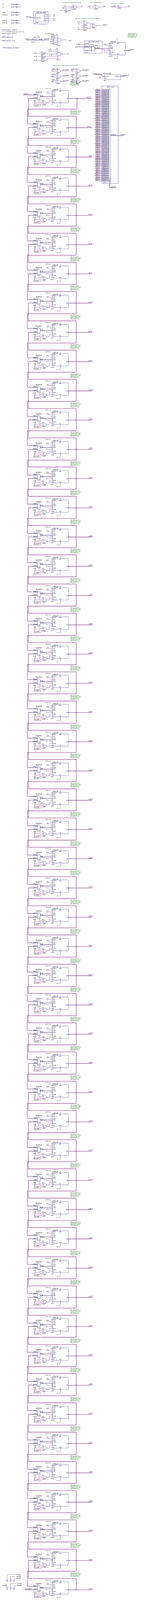
[diagram p0: schematic sheet, whole]
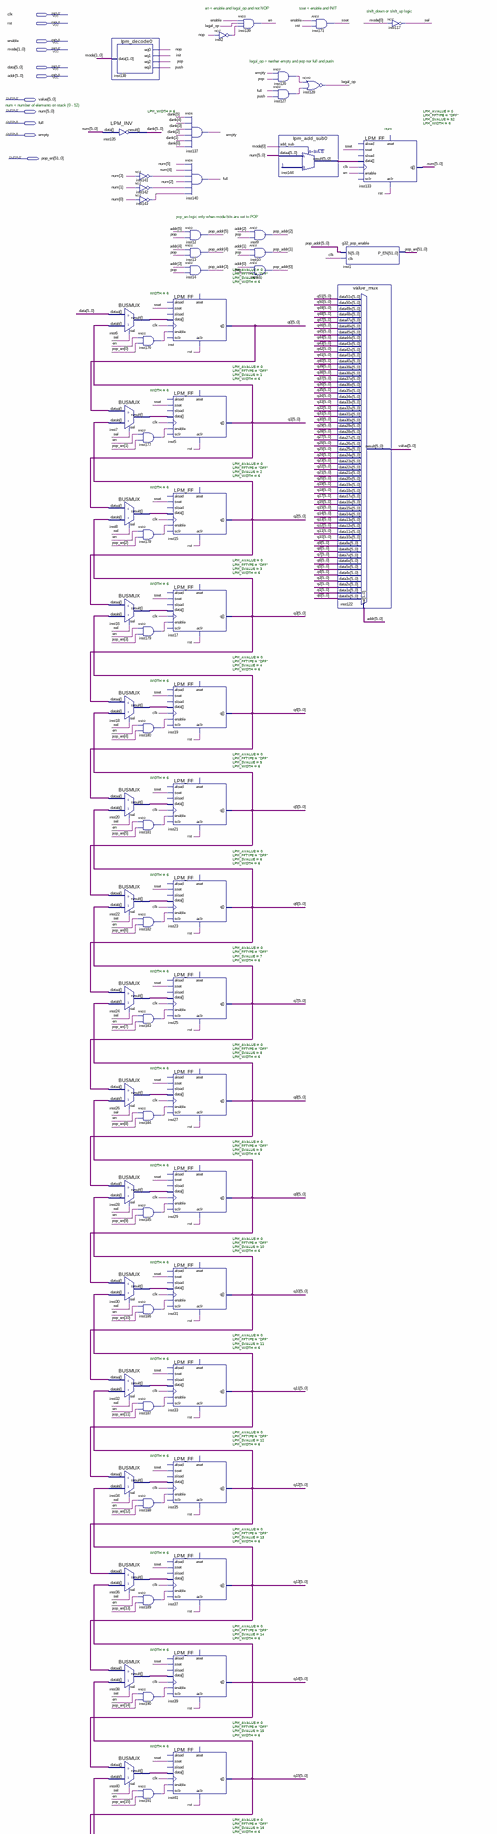
[diagram p1: schematic sheet, upper part]
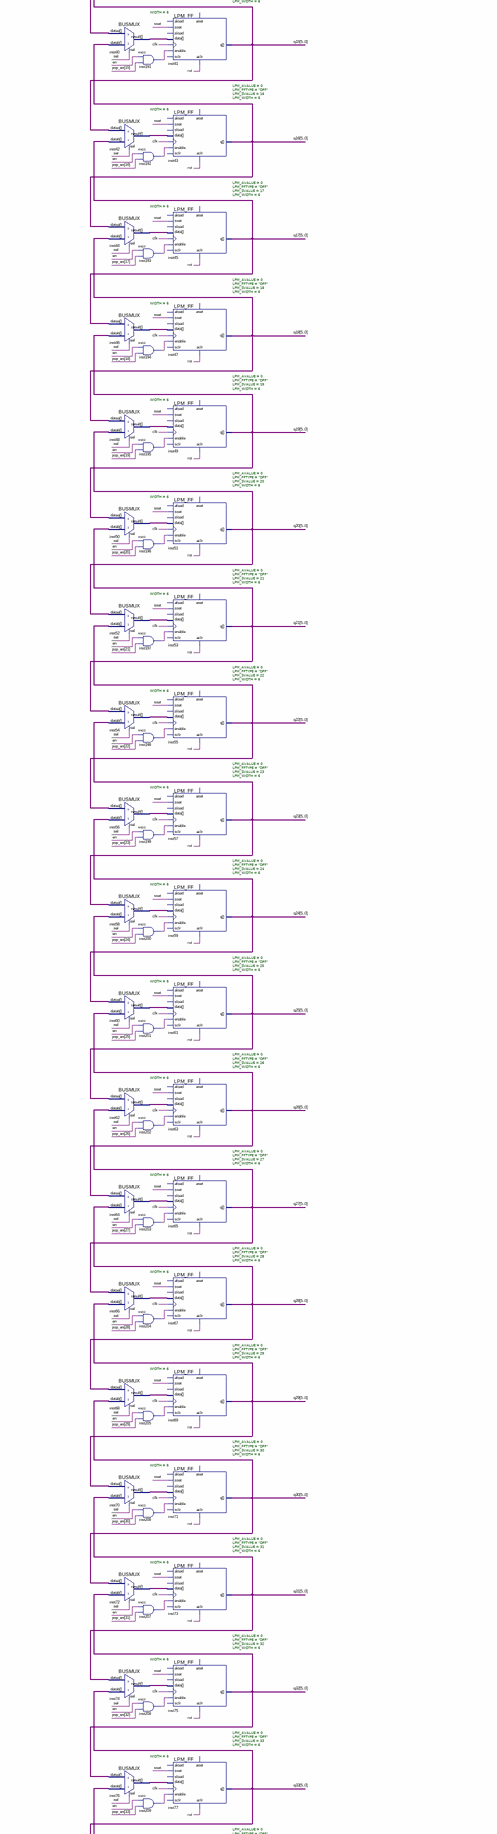
[diagram p2: schematic sheet, middle part]
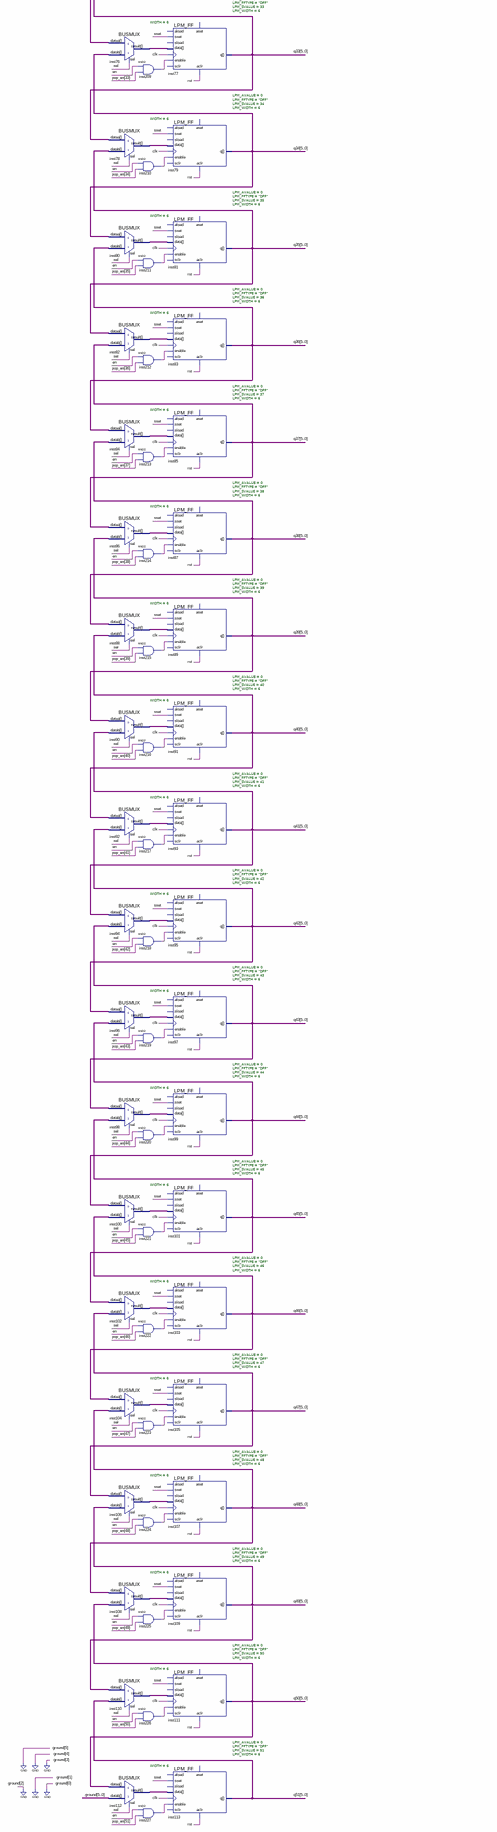
[diagram p3: schematic sheet, lower part]
// Quartus schematic g32_52_element_stack.bdf as structural Verilog: 180 symbols, 11 pins
module g32_52_element_stack (
  input  clk,
  input  rst,
  input  enable,
  input  [1:0] mode,
  input  [5:0] data,
  input  [5:0] addr,
  output [5:0] value,
  output [5:0] num,
  output full,
  output empty,
  output [51:0] pop_en
);

  wire en, init, inst2_out, inst126_out, inst127_out, inst141_out, inst142_out, inst143_out, inst176_out,
       inst177_out, inst178_out, inst179_out, inst180_out, inst181_out, inst182_out, inst183_out,
       inst184_out, inst185_out, inst186_out, inst187_out, inst188_out, inst189_out, inst190_out,
       inst191_out, inst192_out, inst193_out, inst194_out, inst195_out, inst196_out, inst197_out,
       inst198_out, inst199_out, inst200_out, inst201_out, inst202_out, inst203_out, inst204_out,
       inst205_out, inst206_out, inst207_out, inst208_out, inst209_out, inst210_out, inst211_out,
       inst212_out, inst213_out, inst214_out, inst215_out, inst216_out, inst217_out, inst218_out,
       inst219_out, inst220_out, inst221_out, inst222_out, inst223_out, inst224_out, inst225_out,
       inst226_out, inst227_out, legal_op, nop, pop, push, sel, sset;
  wire [5:0] dank, inst6_result, inst7_result, inst8_result, inst16_result, inst18_result, inst20_result,
       inst22_result, inst24_result, inst26_result, inst28_result, inst30_result, inst32_result,
       inst34_result, inst36_result, inst38_result, inst40_result, inst42_result, inst44_result,
       inst46_result, inst48_result, inst50_result, inst52_result, inst54_result, inst56_result,
       inst58_result, inst60_result, inst62_result, inst64_result, inst66_result, inst68_result,
       inst70_result, inst72_result, inst74_result, inst76_result, inst78_result, inst80_result,
       inst82_result, inst84_result, inst86_result, inst88_result, inst90_result, inst92_result,
       inst94_result, inst96_result, inst98_result, inst100_result, inst102_result, inst104_result,
       inst106_result, inst108_result, inst110_result, inst112_result, inst144_result, pop_addr, q0, q1, q2,
       q3, q4, q5, q6, q7, q8, q9, q10, q11, q12, q13, q14, q15, q16, q17, q18, q19, q20, q21, q22, q23, q24,
       q25, q26, q27, q28, q29, q30, q31, q32, q33, q34, q35, q36, q37, q38, q39, q40, q41, q42, q43, q44,
       q45, q46, q47, q48, q49, q50, q51;

  lpm_decode0 inst138 (.data(mode), .eq0(nop), .eq1(init), .eq2(pop), .eq3(push));
  LPM_INV #(.LPM_WIDTH(6)) inst135 (.data(num), .result(dank));
  BUSMUX #(.WIDTH(6)) inst6 (.datab(q1), .sel(sel), .dataa(data), .result(inst6_result));
  BUSMUX #(.WIDTH(6)) inst7 (.datab(q2), .sel(sel), .dataa(q0), .result(inst7_result));
  BUSMUX #(.WIDTH(6)) inst8 (.datab(q3), .sel(sel), .dataa(q1), .result(inst8_result));
  BUSMUX #(.WIDTH(6)) inst16 (.datab(q4), .sel(sel), .dataa(q2), .result(inst16_result));
  BUSMUX #(.WIDTH(6)) inst18 (.datab(q5), .sel(sel), .dataa(q3), .result(inst18_result));
  BUSMUX #(.WIDTH(6)) inst20 (.datab(q6), .sel(sel), .dataa(q4), .result(inst20_result));
  BUSMUX #(.WIDTH(6)) inst22 (.datab(q7), .sel(sel), .dataa(q5), .result(inst22_result));
  BUSMUX #(.WIDTH(6)) inst24 (.datab(q8), .sel(sel), .dataa(q6), .result(inst24_result));
  BUSMUX #(.WIDTH(6)) inst26 (.datab(q9), .sel(sel), .dataa(q7), .result(inst26_result));
  BUSMUX #(.WIDTH(6)) inst28 (.datab(q10), .sel(sel), .dataa(q8), .result(inst28_result));
  BUSMUX #(.WIDTH(6)) inst30 (.datab(q11), .sel(sel), .dataa(q9), .result(inst30_result));
  BUSMUX #(.WIDTH(6)) inst32 (.datab(q12), .sel(sel), .dataa(q10), .result(inst32_result));
  BUSMUX #(.WIDTH(6)) inst34 (.datab(q13), .sel(sel), .dataa(q11), .result(inst34_result));
  BUSMUX #(.WIDTH(6)) inst36 (.datab(q14), .sel(sel), .dataa(q12), .result(inst36_result));
  BUSMUX #(.WIDTH(6)) inst38 (.datab(q15), .sel(sel), .dataa(q13), .result(inst38_result));
  BUSMUX #(.WIDTH(6)) inst40 (.datab(q16), .sel(sel), .dataa(q14), .result(inst40_result));
  BUSMUX #(.WIDTH(6)) inst42 (.datab(q17), .sel(sel), .dataa(q15), .result(inst42_result));
  BUSMUX #(.WIDTH(6)) inst44 (.datab(q18), .sel(sel), .dataa(q16), .result(inst44_result));
  BUSMUX #(.WIDTH(6)) inst46 (.datab(q19), .sel(sel), .dataa(q17), .result(inst46_result));
  BUSMUX #(.WIDTH(6)) inst48 (.datab(q20), .sel(sel), .dataa(q18), .result(inst48_result));
  BUSMUX #(.WIDTH(6)) inst50 (.datab(q21), .sel(sel), .dataa(q19), .result(inst50_result));
  BUSMUX #(.WIDTH(6)) inst52 (.datab(q22), .sel(sel), .dataa(q20), .result(inst52_result));
  BUSMUX #(.WIDTH(6)) inst54 (.datab(q23), .sel(sel), .dataa(q21), .result(inst54_result));
  BUSMUX #(.WIDTH(6)) inst56 (.datab(q24), .sel(sel), .dataa(q22), .result(inst56_result));
  BUSMUX #(.WIDTH(6)) inst58 (.datab(q25), .sel(sel), .dataa(q23), .result(inst58_result));
  BUSMUX #(.WIDTH(6)) inst60 (.datab(q26), .sel(sel), .dataa(q24), .result(inst60_result));
  BUSMUX #(.WIDTH(6)) inst62 (.datab(q27), .sel(sel), .dataa(q25), .result(inst62_result));
  BUSMUX #(.WIDTH(6)) inst64 (.datab(q28), .sel(sel), .dataa(q26), .result(inst64_result));
  BUSMUX #(.WIDTH(6)) inst66 (.datab(q29), .sel(sel), .dataa(q27), .result(inst66_result));
  BUSMUX #(.WIDTH(6)) inst68 (.datab(q30), .sel(sel), .dataa(q28), .result(inst68_result));
  BUSMUX #(.WIDTH(6)) inst70 (.datab(q31), .sel(sel), .dataa(q29), .result(inst70_result));
  BUSMUX #(.WIDTH(6)) inst72 (.datab(q32), .sel(sel), .dataa(q30), .result(inst72_result));
  BUSMUX #(.WIDTH(6)) inst74 (.datab(q33), .sel(sel), .dataa(q31), .result(inst74_result));
  BUSMUX #(.WIDTH(6)) inst76 (.datab(q34), .sel(sel), .dataa(q32), .result(inst76_result));
  BUSMUX #(.WIDTH(6)) inst78 (.datab(q35), .sel(sel), .dataa(q33), .result(inst78_result));
  BUSMUX #(.WIDTH(6)) inst80 (.datab(q36), .sel(sel), .dataa(q34), .result(inst80_result));
  BUSMUX #(.WIDTH(6)) inst82 (.datab(q37), .sel(sel), .dataa(q35), .result(inst82_result));
  BUSMUX #(.WIDTH(6)) inst84 (.datab(q38), .sel(sel), .dataa(q36), .result(inst84_result));
  BUSMUX #(.WIDTH(6)) inst86 (.datab(q39), .sel(sel), .dataa(q37), .result(inst86_result));
  BUSMUX #(.WIDTH(6)) inst88 (.datab(q40), .sel(sel), .dataa(q38), .result(inst88_result));
  BUSMUX #(.WIDTH(6)) inst90 (.datab(q41), .sel(sel), .dataa(q39), .result(inst90_result));
  BUSMUX #(.WIDTH(6)) inst92 (.datab(q42), .sel(sel), .dataa(q40), .result(inst92_result));
  BUSMUX #(.WIDTH(6)) inst94 (.datab(q43), .sel(sel), .dataa(q41), .result(inst94_result));
  BUSMUX #(.WIDTH(6)) inst96 (.datab(q44), .sel(sel), .dataa(q42), .result(inst96_result));
  BUSMUX #(.WIDTH(6)) inst98 (.datab(q45), .sel(sel), .dataa(q43), .result(inst98_result));
  BUSMUX #(.WIDTH(6)) inst100 (.datab(q46), .sel(sel), .dataa(q44), .result(inst100_result));
  BUSMUX #(.WIDTH(6)) inst102 (.datab(q47), .sel(sel), .dataa(q45), .result(inst102_result));
  BUSMUX #(.WIDTH(6)) inst104 (.datab(q48), .sel(sel), .dataa(q46), .result(inst104_result));
  BUSMUX #(.WIDTH(6)) inst106 (.datab(q49), .sel(sel), .dataa(q47), .result(inst106_result));
  BUSMUX #(.WIDTH(6)) inst108 (.datab(q50), .sel(sel), .dataa(q48), .result(inst108_result));
  BUSMUX #(.WIDTH(6)) inst110 (.datab(q51), .sel(sel), .dataa(q49), .result(inst110_result));
  BUSMUX #(.WIDTH(6)) inst112 (.datab({6{1'b0}}), .sel(sel), .dataa(q50), .result(inst112_result));
  not inst141 (inst141_out, num[3]);
  not inst142 (inst142_out, num[1]);
  not inst143 (inst143_out, num[0]);
  and inst176 (inst176_out, en, pop_en[0]);
  and inst177 (inst177_out, en, pop_en[1]);
  and inst178 (inst178_out, en, pop_en[2]);
  and inst179 (inst179_out, en, pop_en[3]);
  and inst180 (inst180_out, en, pop_en[4]);
  and inst181 (inst181_out, en, pop_en[5]);
  and inst182 (inst182_out, en, pop_en[6]);
  and inst183 (inst183_out, en, pop_en[7]);
  and inst184 (inst184_out, en, pop_en[8]);
  and inst185 (inst185_out, en, pop_en[9]);
  and inst186 (inst186_out, en, pop_en[10]);
  and inst187 (inst187_out, en, pop_en[11]);
  and inst188 (inst188_out, en, pop_en[12]);
  and inst189 (inst189_out, en, pop_en[13]);
  and inst190 (inst190_out, en, pop_en[14]);
  and inst191 (inst191_out, en, pop_en[15]);
  and inst192 (inst192_out, en, pop_en[16]);
  and inst193 (inst193_out, en, pop_en[17]);
  and inst194 (inst194_out, en, pop_en[18]);
  and inst195 (inst195_out, en, pop_en[19]);
  and inst196 (inst196_out, en, pop_en[20]);
  and inst197 (inst197_out, en, pop_en[21]);
  and inst198 (inst198_out, en, pop_en[22]);
  and inst199 (inst199_out, en, pop_en[23]);
  and inst200 (inst200_out, en, pop_en[24]);
  and inst201 (inst201_out, en, pop_en[25]);
  and inst202 (inst202_out, en, pop_en[26]);
  and inst203 (inst203_out, en, pop_en[27]);
  and inst204 (inst204_out, en, pop_en[28]);
  and inst205 (inst205_out, en, pop_en[29]);
  and inst206 (inst206_out, en, pop_en[30]);
  and inst207 (inst207_out, en, pop_en[31]);
  and inst208 (inst208_out, en, pop_en[32]);
  and inst209 (inst209_out, en, pop_en[33]);
  and inst210 (inst210_out, en, pop_en[34]);
  and inst211 (inst211_out, en, pop_en[35]);
  and inst212 (inst212_out, en, pop_en[36]);
  and inst213 (inst213_out, en, pop_en[37]);
  and inst214 (inst214_out, en, pop_en[38]);
  and inst215 (inst215_out, en, pop_en[39]);
  and inst216 (inst216_out, en, pop_en[40]);
  and inst217 (inst217_out, en, pop_en[41]);
  and inst218 (inst218_out, en, pop_en[42]);
  and inst219 (inst219_out, en, pop_en[43]);
  and inst220 (inst220_out, en, pop_en[44]);
  and inst221 (inst221_out, en, pop_en[45]);
  and inst222 (inst222_out, en, pop_en[46]);
  and inst223 (inst223_out, en, pop_en[47]);
  and inst224 (inst224_out, en, pop_en[48]);
  and inst225 (inst225_out, en, pop_en[49]);
  and inst226 (inst226_out, en, pop_en[50]);
  and inst227 (inst227_out, en, pop_en[51]);
  LPM_FF #(.LPM_AVALUE(0), .LPM_FFTYPE("DFF"), .LPM_SVALUE(0), .LPM_WIDTH(6)) inst (
    .enable(inst176_out), .clock(clk), .sset(sset), .aclr(rst), .data(inst6_result), .q(q0));  // open: aload, sload, aset, sclr
  LPM_FF #(.LPM_AVALUE(0), .LPM_FFTYPE("DFF"), .LPM_SVALUE(1), .LPM_WIDTH(6)) inst5 (
    .enable(inst177_out), .clock(clk), .sset(sset), .aclr(rst), .data(inst7_result), .q(q1));  // open: aload, sload, aset, sclr
  LPM_FF #(.LPM_AVALUE(0), .LPM_FFTYPE("DFF"), .LPM_SVALUE(2), .LPM_WIDTH(6)) inst15 (
    .enable(inst178_out), .clock(clk), .sset(sset), .aclr(rst), .data(inst8_result), .q(q2));  // open: aload, sload, aset, sclr
  LPM_FF #(.LPM_AVALUE(0), .LPM_FFTYPE("DFF"), .LPM_SVALUE(3), .LPM_WIDTH(6)) inst17 (
    .enable(inst179_out), .clock(clk), .sset(sset), .aclr(rst), .data(inst16_result), .q(q3));  // open: aload, sload, aset, sclr
  LPM_FF #(.LPM_AVALUE(0), .LPM_FFTYPE("DFF"), .LPM_SVALUE(4), .LPM_WIDTH(6)) inst19 (
    .enable(inst180_out), .clock(clk), .sset(sset), .aclr(rst), .data(inst18_result), .q(q4));  // open: aload, sload, aset, sclr
  LPM_FF #(.LPM_AVALUE(0), .LPM_FFTYPE("DFF"), .LPM_SVALUE(5), .LPM_WIDTH(6)) inst21 (
    .enable(inst181_out), .clock(clk), .sset(sset), .aclr(rst), .data(inst20_result), .q(q5));  // open: aload, sload, aset, sclr
  LPM_FF #(.LPM_AVALUE(0), .LPM_FFTYPE("DFF"), .LPM_SVALUE(6), .LPM_WIDTH(6)) inst23 (
    .enable(inst182_out), .clock(clk), .sset(sset), .aclr(rst), .data(inst22_result), .q(q6));  // open: aload, sload, aset, sclr
  LPM_FF #(.LPM_AVALUE(0), .LPM_FFTYPE("DFF"), .LPM_SVALUE(7), .LPM_WIDTH(6)) inst25 (
    .enable(inst183_out), .clock(clk), .sset(sset), .aclr(rst), .data(inst24_result), .q(q7));  // open: aload, sload, aset, sclr
  LPM_FF #(.LPM_AVALUE(0), .LPM_FFTYPE("DFF"), .LPM_SVALUE(8), .LPM_WIDTH(6)) inst27 (
    .enable(inst184_out), .clock(clk), .sset(sset), .aclr(rst), .data(inst26_result), .q(q8));  // open: aload, sload, aset, sclr
  LPM_FF #(.LPM_AVALUE(0), .LPM_FFTYPE("DFF"), .LPM_SVALUE(9), .LPM_WIDTH(6)) inst29 (
    .enable(inst185_out), .clock(clk), .sset(sset), .aclr(rst), .data(inst28_result), .q(q9));  // open: aload, sload, aset, sclr
  LPM_FF #(.LPM_AVALUE(0), .LPM_FFTYPE("DFF"), .LPM_SVALUE(10), .LPM_WIDTH(6)) inst31 (
    .enable(inst186_out), .clock(clk), .sset(sset), .aclr(rst), .data(inst30_result), .q(q10));  // open: aload, sload, aset, sclr
  LPM_FF #(.LPM_AVALUE(0), .LPM_FFTYPE("DFF"), .LPM_SVALUE(11), .LPM_WIDTH(6)) inst33 (
    .enable(inst187_out), .clock(clk), .sset(sset), .aclr(rst), .data(inst32_result), .q(q11));  // open: aload, sload, aset, sclr
  LPM_FF #(.LPM_AVALUE(0), .LPM_FFTYPE("DFF"), .LPM_SVALUE(12), .LPM_WIDTH(6)) inst35 (
    .enable(inst188_out), .clock(clk), .sset(sset), .aclr(rst), .data(inst34_result), .q(q12));  // open: aload, sload, aset, sclr
  LPM_FF #(.LPM_AVALUE(0), .LPM_FFTYPE("DFF"), .LPM_SVALUE(13), .LPM_WIDTH(6)) inst37 (
    .enable(inst189_out), .clock(clk), .sset(sset), .aclr(rst), .data(inst36_result), .q(q13));  // open: aload, sload, aset, sclr
  LPM_FF #(.LPM_AVALUE(0), .LPM_FFTYPE("DFF"), .LPM_SVALUE(14), .LPM_WIDTH(6)) inst39 (
    .enable(inst190_out), .clock(clk), .sset(sset), .aclr(rst), .data(inst38_result), .q(q14));  // open: aload, sload, aset, sclr
  LPM_FF #(.LPM_AVALUE(0), .LPM_FFTYPE("DFF"), .LPM_SVALUE(15), .LPM_WIDTH(6)) inst41 (
    .enable(inst191_out), .clock(clk), .sset(sset), .aclr(rst), .data(inst40_result), .q(q15));  // open: aload, sload, aset, sclr
  LPM_FF #(.LPM_AVALUE(0), .LPM_FFTYPE("DFF"), .LPM_SVALUE(16), .LPM_WIDTH(6)) inst43 (
    .enable(inst192_out), .clock(clk), .sset(sset), .aclr(rst), .data(inst42_result), .q(q16));  // open: aload, sload, aset, sclr
  LPM_FF #(.LPM_AVALUE(0), .LPM_FFTYPE("DFF"), .LPM_SVALUE(17), .LPM_WIDTH(6)) inst45 (
    .enable(inst193_out), .clock(clk), .sset(sset), .aclr(rst), .data(inst44_result), .q(q17));  // open: aload, sload, aset, sclr
  LPM_FF #(.LPM_AVALUE(0), .LPM_FFTYPE("DFF"), .LPM_SVALUE(18), .LPM_WIDTH(6)) inst47 (
    .enable(inst194_out), .clock(clk), .sset(sset), .aclr(rst), .data(inst46_result), .q(q18));  // open: aload, sload, aset, sclr
  LPM_FF #(.LPM_AVALUE(0), .LPM_FFTYPE("DFF"), .LPM_SVALUE(19), .LPM_WIDTH(6)) inst49 (
    .enable(inst195_out), .clock(clk), .sset(sset), .aclr(rst), .data(inst48_result), .q(q19));  // open: aload, sload, aset, sclr
  LPM_FF #(.LPM_AVALUE(0), .LPM_FFTYPE("DFF"), .LPM_SVALUE(20), .LPM_WIDTH(6)) inst51 (
    .enable(inst196_out), .clock(clk), .sset(sset), .aclr(rst), .data(inst50_result), .q(q20));  // open: aload, sload, aset, sclr
  LPM_FF #(.LPM_AVALUE(0), .LPM_FFTYPE("DFF"), .LPM_SVALUE(21), .LPM_WIDTH(6)) inst53 (
    .enable(inst197_out), .clock(clk), .sset(sset), .aclr(rst), .data(inst52_result), .q(q21));  // open: aload, sload, aset, sclr
  LPM_FF #(.LPM_AVALUE(0), .LPM_FFTYPE("DFF"), .LPM_SVALUE(22), .LPM_WIDTH(6)) inst55 (
    .enable(inst198_out), .clock(clk), .sset(sset), .aclr(rst), .data(inst54_result), .q(q22));  // open: aload, sload, aset, sclr
  LPM_FF #(.LPM_AVALUE(0), .LPM_FFTYPE("DFF"), .LPM_SVALUE(23), .LPM_WIDTH(6)) inst57 (
    .enable(inst199_out), .clock(clk), .sset(sset), .aclr(rst), .data(inst56_result), .q(q23));  // open: aload, sload, aset, sclr
  LPM_FF #(.LPM_AVALUE(0), .LPM_FFTYPE("DFF"), .LPM_SVALUE(24), .LPM_WIDTH(6)) inst59 (
    .enable(inst200_out), .clock(clk), .sset(sset), .aclr(rst), .data(inst58_result), .q(q24));  // open: aload, sload, aset, sclr
  LPM_FF #(.LPM_AVALUE(0), .LPM_FFTYPE("DFF"), .LPM_SVALUE(25), .LPM_WIDTH(6)) inst61 (
    .enable(inst201_out), .clock(clk), .sset(sset), .aclr(rst), .data(inst60_result), .q(q25));  // open: aload, sload, aset, sclr
  LPM_FF #(.LPM_AVALUE(0), .LPM_FFTYPE("DFF"), .LPM_SVALUE(26), .LPM_WIDTH(6)) inst63 (
    .enable(inst202_out), .clock(clk), .sset(sset), .aclr(rst), .data(inst62_result), .q(q26));  // open: aload, sload, aset, sclr
  LPM_FF #(.LPM_AVALUE(0), .LPM_FFTYPE("DFF"), .LPM_SVALUE(27), .LPM_WIDTH(6)) inst65 (
    .enable(inst203_out), .clock(clk), .sset(sset), .aclr(rst), .data(inst64_result), .q(q27));  // open: aload, sload, aset, sclr
  LPM_FF #(.LPM_AVALUE(0), .LPM_FFTYPE("DFF"), .LPM_SVALUE(28), .LPM_WIDTH(6)) inst67 (
    .enable(inst204_out), .clock(clk), .sset(sset), .aclr(rst), .data(inst66_result), .q(q28));  // open: aload, sload, aset, sclr
  LPM_FF #(.LPM_AVALUE(0), .LPM_FFTYPE("DFF"), .LPM_SVALUE(29), .LPM_WIDTH(6)) inst69 (
    .enable(inst205_out), .clock(clk), .sset(sset), .aclr(rst), .data(inst68_result), .q(q29));  // open: aload, sload, aset, sclr
  LPM_FF #(.LPM_AVALUE(0), .LPM_FFTYPE("DFF"), .LPM_SVALUE(30), .LPM_WIDTH(6)) inst71 (
    .enable(inst206_out), .clock(clk), .sset(sset), .aclr(rst), .data(inst70_result), .q(q30));  // open: aload, sload, aset, sclr
  LPM_FF #(.LPM_AVALUE(0), .LPM_FFTYPE("DFF"), .LPM_SVALUE(31), .LPM_WIDTH(6)) inst73 (
    .enable(inst207_out), .clock(clk), .sset(sset), .aclr(rst), .data(inst72_result), .q(q31));  // open: aload, sload, aset, sclr
  LPM_FF #(.LPM_AVALUE(0), .LPM_FFTYPE("DFF"), .LPM_SVALUE(32), .LPM_WIDTH(6)) inst75 (
    .enable(inst208_out), .clock(clk), .sset(sset), .aclr(rst), .data(inst74_result), .q(q32));  // open: aload, sload, aset, sclr
  LPM_FF #(.LPM_AVALUE(0), .LPM_FFTYPE("DFF"), .LPM_SVALUE(33), .LPM_WIDTH(6)) inst77 (
    .enable(inst209_out), .clock(clk), .sset(sset), .aclr(rst), .data(inst76_result), .q(q33));  // open: aload, sload, aset, sclr
  LPM_FF #(.LPM_AVALUE(0), .LPM_FFTYPE("DFF"), .LPM_SVALUE(34), .LPM_WIDTH(6)) inst79 (
    .enable(inst210_out), .clock(clk), .sset(sset), .aclr(rst), .data(inst78_result), .q(q34));  // open: aload, sload, aset, sclr
  LPM_FF #(.LPM_AVALUE(0), .LPM_FFTYPE("DFF"), .LPM_SVALUE(35), .LPM_WIDTH(6)) inst81 (
    .enable(inst211_out), .clock(clk), .sset(sset), .aclr(rst), .data(inst80_result), .q(q35));  // open: aload, sload, aset, sclr
  LPM_FF #(.LPM_AVALUE(0), .LPM_FFTYPE("DFF"), .LPM_SVALUE(36), .LPM_WIDTH(6)) inst83 (
    .enable(inst212_out), .clock(clk), .sset(sset), .aclr(rst), .data(inst82_result), .q(q36));  // open: aload, sload, aset, sclr
  LPM_FF #(.LPM_AVALUE(0), .LPM_FFTYPE("DFF"), .LPM_SVALUE(37), .LPM_WIDTH(6)) inst85 (
    .enable(inst213_out), .clock(clk), .sset(sset), .aclr(rst), .data(inst84_result), .q(q37));  // open: aload, sload, aset, sclr
  LPM_FF #(.LPM_AVALUE(0), .LPM_FFTYPE("DFF"), .LPM_SVALUE(38), .LPM_WIDTH(6)) inst87 (
    .enable(inst214_out), .clock(clk), .sset(sset), .aclr(rst), .data(inst86_result), .q(q38));  // open: aload, sload, aset, sclr
  LPM_FF #(.LPM_AVALUE(0), .LPM_FFTYPE("DFF"), .LPM_SVALUE(39), .LPM_WIDTH(6)) inst89 (
    .enable(inst215_out), .clock(clk), .sset(sset), .aclr(rst), .data(inst88_result), .q(q39));  // open: aload, sload, aset, sclr
  LPM_FF #(.LPM_AVALUE(0), .LPM_FFTYPE("DFF"), .LPM_SVALUE(40), .LPM_WIDTH(6)) inst91 (
    .enable(inst216_out), .clock(clk), .sset(sset), .aclr(rst), .data(inst90_result), .q(q40));  // open: aload, sload, aset, sclr
  LPM_FF #(.LPM_AVALUE(0), .LPM_FFTYPE("DFF"), .LPM_SVALUE(41), .LPM_WIDTH(6)) inst93 (
    .enable(inst217_out), .clock(clk), .sset(sset), .aclr(rst), .data(inst92_result), .q(q41));  // open: aload, sload, aset, sclr
  LPM_FF #(.LPM_AVALUE(0), .LPM_FFTYPE("DFF"), .LPM_SVALUE(42), .LPM_WIDTH(6)) inst95 (
    .enable(inst218_out), .clock(clk), .sset(sset), .aclr(rst), .data(inst94_result), .q(q42));  // open: aload, sload, aset, sclr
  LPM_FF #(.LPM_AVALUE(0), .LPM_FFTYPE("DFF"), .LPM_SVALUE(43), .LPM_WIDTH(6)) inst97 (
    .enable(inst219_out), .clock(clk), .sset(sset), .aclr(rst), .data(inst96_result), .q(q43));  // open: aload, sload, aset, sclr
  LPM_FF #(.LPM_AVALUE(0), .LPM_FFTYPE("DFF"), .LPM_SVALUE(44), .LPM_WIDTH(6)) inst99 (
    .enable(inst220_out), .clock(clk), .sset(sset), .aclr(rst), .data(inst98_result), .q(q44));  // open: aload, sload, aset, sclr
  LPM_FF #(.LPM_AVALUE(0), .LPM_FFTYPE("DFF"), .LPM_SVALUE(45), .LPM_WIDTH(6)) inst101 (
    .enable(inst221_out), .clock(clk), .sset(sset), .aclr(rst), .data(inst100_result), .q(q45));  // open: aload, sload, aset, sclr
  LPM_FF #(.LPM_AVALUE(0), .LPM_FFTYPE("DFF"), .LPM_SVALUE(46), .LPM_WIDTH(6)) inst103 (
    .enable(inst222_out), .clock(clk), .sset(sset), .aclr(rst), .data(inst102_result), .q(q46));  // open: aload, sload, aset, sclr
  LPM_FF #(.LPM_AVALUE(0), .LPM_FFTYPE("DFF"), .LPM_SVALUE(47), .LPM_WIDTH(6)) inst105 (
    .enable(inst223_out), .clock(clk), .sset(sset), .aclr(rst), .data(inst104_result), .q(q47));  // open: aload, sload, aset, sclr
  LPM_FF #(.LPM_AVALUE(0), .LPM_FFTYPE("DFF"), .LPM_SVALUE(48), .LPM_WIDTH(6)) inst107 (
    .enable(inst224_out), .clock(clk), .sset(sset), .aclr(rst), .data(inst106_result), .q(q48));  // open: aload, sload, aset, sclr
  LPM_FF #(.LPM_AVALUE(0), .LPM_FFTYPE("DFF"), .LPM_SVALUE(49), .LPM_WIDTH(6)) inst109 (
    .enable(inst225_out), .clock(clk), .sset(sset), .aclr(rst), .data(inst108_result), .q(q49));  // open: aload, sload, aset, sclr
  LPM_FF #(.LPM_AVALUE(0), .LPM_FFTYPE("DFF"), .LPM_SVALUE(50), .LPM_WIDTH(6)) inst111 (
    .enable(inst226_out), .clock(clk), .sset(sset), .aclr(rst), .data(inst110_result), .q(q50));  // open: aload, sload, aset, sclr
  LPM_FF #(.LPM_AVALUE(0), .LPM_FFTYPE("DFF"), .LPM_SVALUE(51), .LPM_WIDTH(6)) inst113 (
    .enable(inst227_out), .clock(clk), .sset(sset), .aclr(rst), .data(inst112_result), .q(q51));  // open: aload, sload, aset, sclr
  and inst137 (empty, dank[5], dank[4], dank[3], dank[2], dank[1], dank[0]);
  and inst140 (full, num[5], num[4], inst141_out, num[2], inst142_out, inst143_out);
  and inst12 (pop_addr[5], addr[5], pop);
  and inst13 (pop_addr[4], addr[4], pop);
  and inst14 (pop_addr[3], addr[3], pop);
  not inst2 (inst2_out, nop);
  and inst139 (en, enable, legal_op, inst2_out);
  and inst9 (pop_addr[2], addr[2], pop);
  and inst10 (pop_addr[1], addr[1], pop);
  and inst11 (pop_addr[0], addr[0], pop);
  and inst126 (inst126_out, empty, pop);
  and inst127 (inst127_out, full, push);
  lpm_add_sub0 inst144 (.add_sub(mode[0]), .dataa(num), .result(inst144_result));
  and inst171 (sset, enable, init);
  nor inst128 (legal_op, inst126_out, inst127_out);
  g32_pop_enable inst1 (.N(pop_addr), .clk(clk), .P_EN(pop_en));
  value_mux inst122 (
    .data51x(q51), .data50x(q50), .data49x(q49), .data48x(q48), .data47x(q47), .data46x(q46), .data45x(q45),
    .data44x(q44), .data43x(q43), .data42x(q42), .data41x(q41), .data40x(q40), .data39x(q39), .data38x(q38),
    .data37x(q37), .data36x(q36), .data35x(q35), .data34x(q34), .data33x(q33), .data32x(q32), .data31x(q31),
    .data30x(q30), .data29x(q29), .data28x(q28), .data27x(q27), .data26x(q26), .data25x(q25), .data24x(q24),
    .data23x(q23), .data22x(q22), .data21x(q21), .data20x(q20), .data19x(q19), .data18x(q18), .data17x(q17),
    .data16x(q16), .data15x(q15), .data14x(q14), .data13x(q13), .data12x(q12), .data11x(q11), .data10x(q10),
    .data9x(q9), .data8x(q8), .data7x(q7), .data6x(q6), .data5x(q5), .data4x(q4), .data3x(q3), .data2x(q2),
    .data1x(q1), .data0x(q0), .sel(addr), .result(value));
  LPM_FF #(.LPM_AVALUE(0), .LPM_FFTYPE("DFF"), .LPM_SVALUE(52), .LPM_WIDTH(6)) inst133 (
    .enable(en), .clock(clk), .sset(sset), .aclr(rst), .data(inst144_result), .q(num));  // open: aload, sload, aset, sclr
  not inst117 (sel, mode[0]);

  // Notes on the sheet:
  //   en = enable and legal_op and not NOP
  //   sset = enable and INIT
  //   shift_down or shift_up logic
  //   legal_op = neither empty and pop nor full and push
  //   num = number of elements on stack (0 - 52)
  //   num
  //   pop_en logic only when mode bits are set to POP
endmodule
